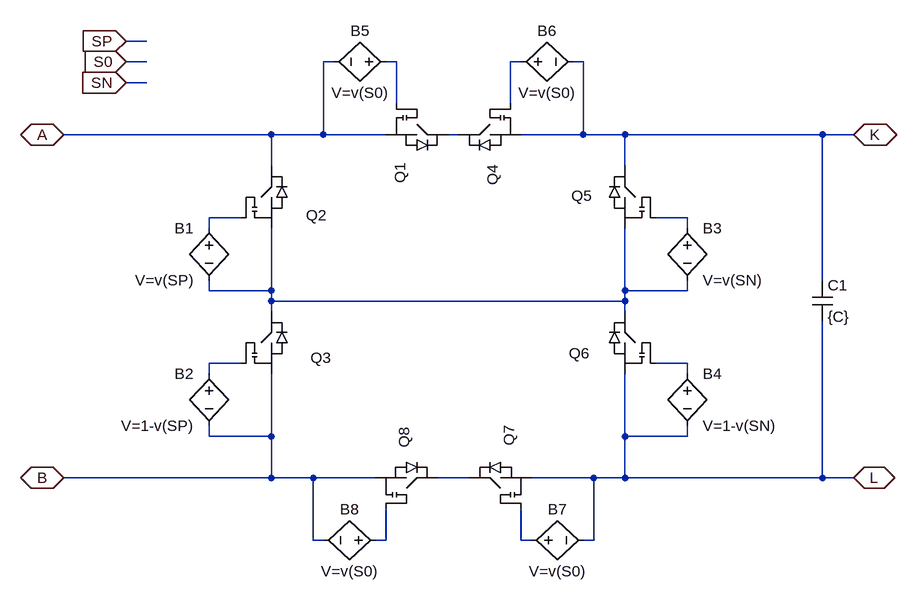
[diagram p0: schematic PN_switching_model.asc]
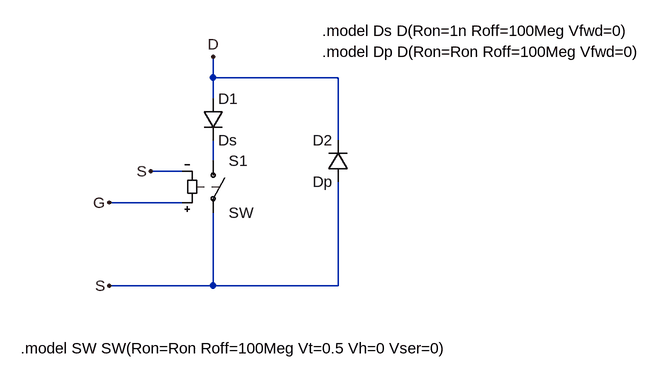
[diagram p1: sub-circuit isw.asc]
PN_switching_model.asc, the LTspice schematic file:
Version 4
SHEET 1 1104 712
WIRE -48 -112 -80 -112
WIRE -48 -80 -80 -80
WIRE 240 -80 224 -80
WIRE 336 -80 320 -80
WIRE 528 -80 512 -80
WIRE 624 -80 608 -80
WIRE -48 -48 -80 -48
WIRE 336 -16 336 -80
WIRE 512 -16 512 -80
WIRE 144 32 -176 32
WIRE 224 32 224 -80
WIRE 224 32 144 32
WIRE 320 32 224 32
WIRE 432 32 416 32
WIRE 624 32 624 -80
WIRE 624 32 528 32
WIRE 688 32 624 32
WIRE 992 32 688 32
WIRE 1040 32 992 32
WIRE 144 80 144 32
WIRE 688 80 688 32
WIRE 96 160 48 160
WIRE 784 160 736 160
WIRE 48 176 48 160
WIRE 784 176 784 160
WIRE 992 256 992 32
WIRE 48 272 48 256
WIRE 144 272 144 176
WIRE 144 272 48 272
WIRE 688 272 688 176
WIRE 784 272 784 256
WIRE 784 272 688 272
WIRE 144 288 144 272
WIRE 688 288 688 272
WIRE 688 288 144 288
WIRE 144 304 144 288
WIRE 688 304 688 288
WIRE 96 384 48 384
WIRE 784 384 736 384
WIRE 48 400 48 384
WIRE 784 400 784 384
WIRE 48 496 48 480
WIRE 144 496 144 400
WIRE 144 496 48 496
WIRE 688 496 688 400
WIRE 784 496 784 480
WIRE 784 496 688 496
WIRE 144 560 144 496
WIRE 144 560 -176 560
WIRE 208 560 144 560
WIRE 304 560 208 560
WIRE 448 560 400 560
WIRE 640 560 544 560
WIRE 688 560 688 496
WIRE 688 560 640 560
WIRE 992 560 992 320
WIRE 992 560 688 560
WIRE 1040 560 992 560
WIRE 208 656 208 560
WIRE 224 656 208 656
WIRE 320 656 320 608
WIRE 320 656 304 656
WIRE 528 656 528 608
WIRE 544 656 528 656
WIRE 640 656 640 560
WIRE 640 656 624 656
FLAG 1040 32 K
IOPIN 1040 32 BiDir
FLAG 1040 560 L
IOPIN 1040 560 BiDir
FLAG -176 32 A
IOPIN -176 32 BiDir
FLAG -176 560 B
IOPIN -176 560 BiDir
FLAG -80 -112 SP
IOPIN -80 -112 In
FLAG -80 -80 S0
IOPIN -80 -80 In
FLAG -80 -48 SN
IOPIN -80 -48 In
SYMBOL bv 48 160 M0
SYMATTR InstName B1
SYMATTR Value V=v(SP)
SYMBOL bv 48 384 M0
SYMATTR InstName B2
SYMATTR Value V=1-v(SP)
SYMBOL bv 784 160 R0
SYMATTR InstName B3
SYMATTR Value V=v(SN)
SYMBOL bv 784 384 R0
SYMATTR InstName B4
SYMATTR Value V=1-v(SN)
SYMBOL bv 336 -80 R90
WINDOW 0 -32 56 VBottom 2
WINDOW 3 32 56 VTop 2
SYMATTR InstName B5
SYMATTR Value V=v(S0)
SYMBOL bv 512 -80 M90
WINDOW 0 -32 56 VBottom 2
WINDOW 3 32 56 VTop 2
SYMATTR InstName B6
SYMATTR Value V=v(S0)
SYMBOL iSW 352 32 R90
WINDOW 0 43 10 Left 2
SYMATTR InstName Q1
SYMATTR SpiceLine Ron=Rswitch
SYMBOL iSW 144 144 R0
WINDOW 0 53 12 Left 2
SYMATTR InstName Q2
SYMATTR SpiceLine Ron=Rswitch
SYMBOL iSW 144 368 R0
WINDOW 0 60 7 Left 2
SYMATTR InstName Q3
SYMATTR SpiceLine Ron=Rswitch
SYMBOL iSW 496 32 M90
WINDOW 0 46 -12 Left 2
SYMATTR InstName Q4
SYMATTR SpiceLine Ron=Rswitch
SYMBOL iSW 688 144 M0
WINDOW 0 50 -18 Left 2
SYMATTR InstName Q5
SYMATTR SpiceLine Ron=Rswitch
SYMBOL iSW 688 368 M0
WINDOW 0 54 0 Left 2
SYMATTR InstName Q6
SYMATTR SpiceLine Ron=Rswitch
SYMBOL cap 976 256 R0
SYMATTR InstName C1
SYMATTR Value {C}
SYMBOL bv 528 656 R270
WINDOW 0 32 56 VTop 2
WINDOW 3 -32 56 VBottom 2
SYMATTR InstName B7
SYMATTR Value V=v(S0)
SYMBOL bv 320 656 M270
WINDOW 0 32 56 VTop 2
WINDOW 3 -32 56 VBottom 2
SYMATTR InstName B8
SYMATTR Value V=v(S0)
SYMBOL iSW 512 560 R270
WINDOW 0 49 -2 Left 2
SYMATTR InstName Q7
SYMATTR SpiceLine Ron=Rswitch
SYMBOL iSW 336 560 M270
WINDOW 0 46 -12 Left 2
SYMATTR InstName Q8
SYMATTR SpiceLine Ron=Rswitch

isw.asc, the sub-circuit schematic file:
Version 4
SHEET 1 880 680
WIRE 160 -32 160 -64
WIRE 352 -32 160 -32
WIRE 160 0 160 -32
WIRE 352 64 352 -32
WIRE 160 96 160 64
WIRE 112 112 64 112
WIRE 112 160 0 160
WIRE 160 288 0 288
WIRE 160 288 160 176
WIRE 352 288 352 128
WIRE 352 288 160 288
FLAG 0 160 G
FLAG 0 288 S
FLAG 160 -64 D
FLAG 64 112 S
SYMBOL sw 160 80 R0
SYMATTR InstName S1
SYMBOL diode 144 0 R0
SYMATTR InstName D1
SYMATTR Value Ds
SYMBOL diode 368 128 R180
WINDOW 0 24 64 Left 2
WINDOW 3 24 0 Left 2
SYMATTR InstName D2
SYMATTR Value Dp
TEXT -136 384 Left 2 !.model SW SW(Ron=Ron Roff=100Meg Vt=0.5 Vh=0 Vser=0)
TEXT 328 -104 Left 2 !.model Ds D(Ron=1n Roff=100Meg Vfwd=0)
TEXT 328 -72 Left 2 !.model Dp D(Ron=Ron Roff=100Meg Vfwd=0)

The netlist it stands for:
* PN_switching_model.asc
B1 N004 N006 V=v(SP)
B2 N007 B V=1-v(SP)
B3 N005 N006 V=v(SN)
B4 N008 L V=1-v(SN)
B5 N001 A V=v(S0)
B6 N002 K V=v(S0)
XQ1 N003 A N001 isw params: Ron=Rswitch
XQ2 A N006 N004 isw params: Ron=Rswitch
XQ3 N006 B N007 isw params: Ron=Rswitch
XQ4 N003 K N002 isw params: Ron=Rswitch
XQ5 K N006 N005 isw params: Ron=Rswitch
XQ6 N006 L N008 isw params: Ron=Rswitch
C1 K L {C}
B7 N011 L V=v(S0)
B8 N010 B V=v(S0)
XQ7 N009 L N011 isw params: Ron=Rswitch
XQ8 N009 B N010 isw params: Ron=Rswitch

* block symbol definitions
.subckt isw D S G
S1 N001 S G S SW
D1 D N001 Ds
D2 S D Dp
.model SW SW(Ron=Ron Roff=100Meg Vt=0.5 Vh=0 Vser=0)
.model Ds D(Ron=1n Roff=100Meg Vfwd=0)
.model Dp D(Ron=Ron Roff=100Meg Vfwd=0)
.ends isw

.model D D
.lib standard.dio
.backanno
.end